# EAGLE design NanoRemote (EAGLE 5.11)
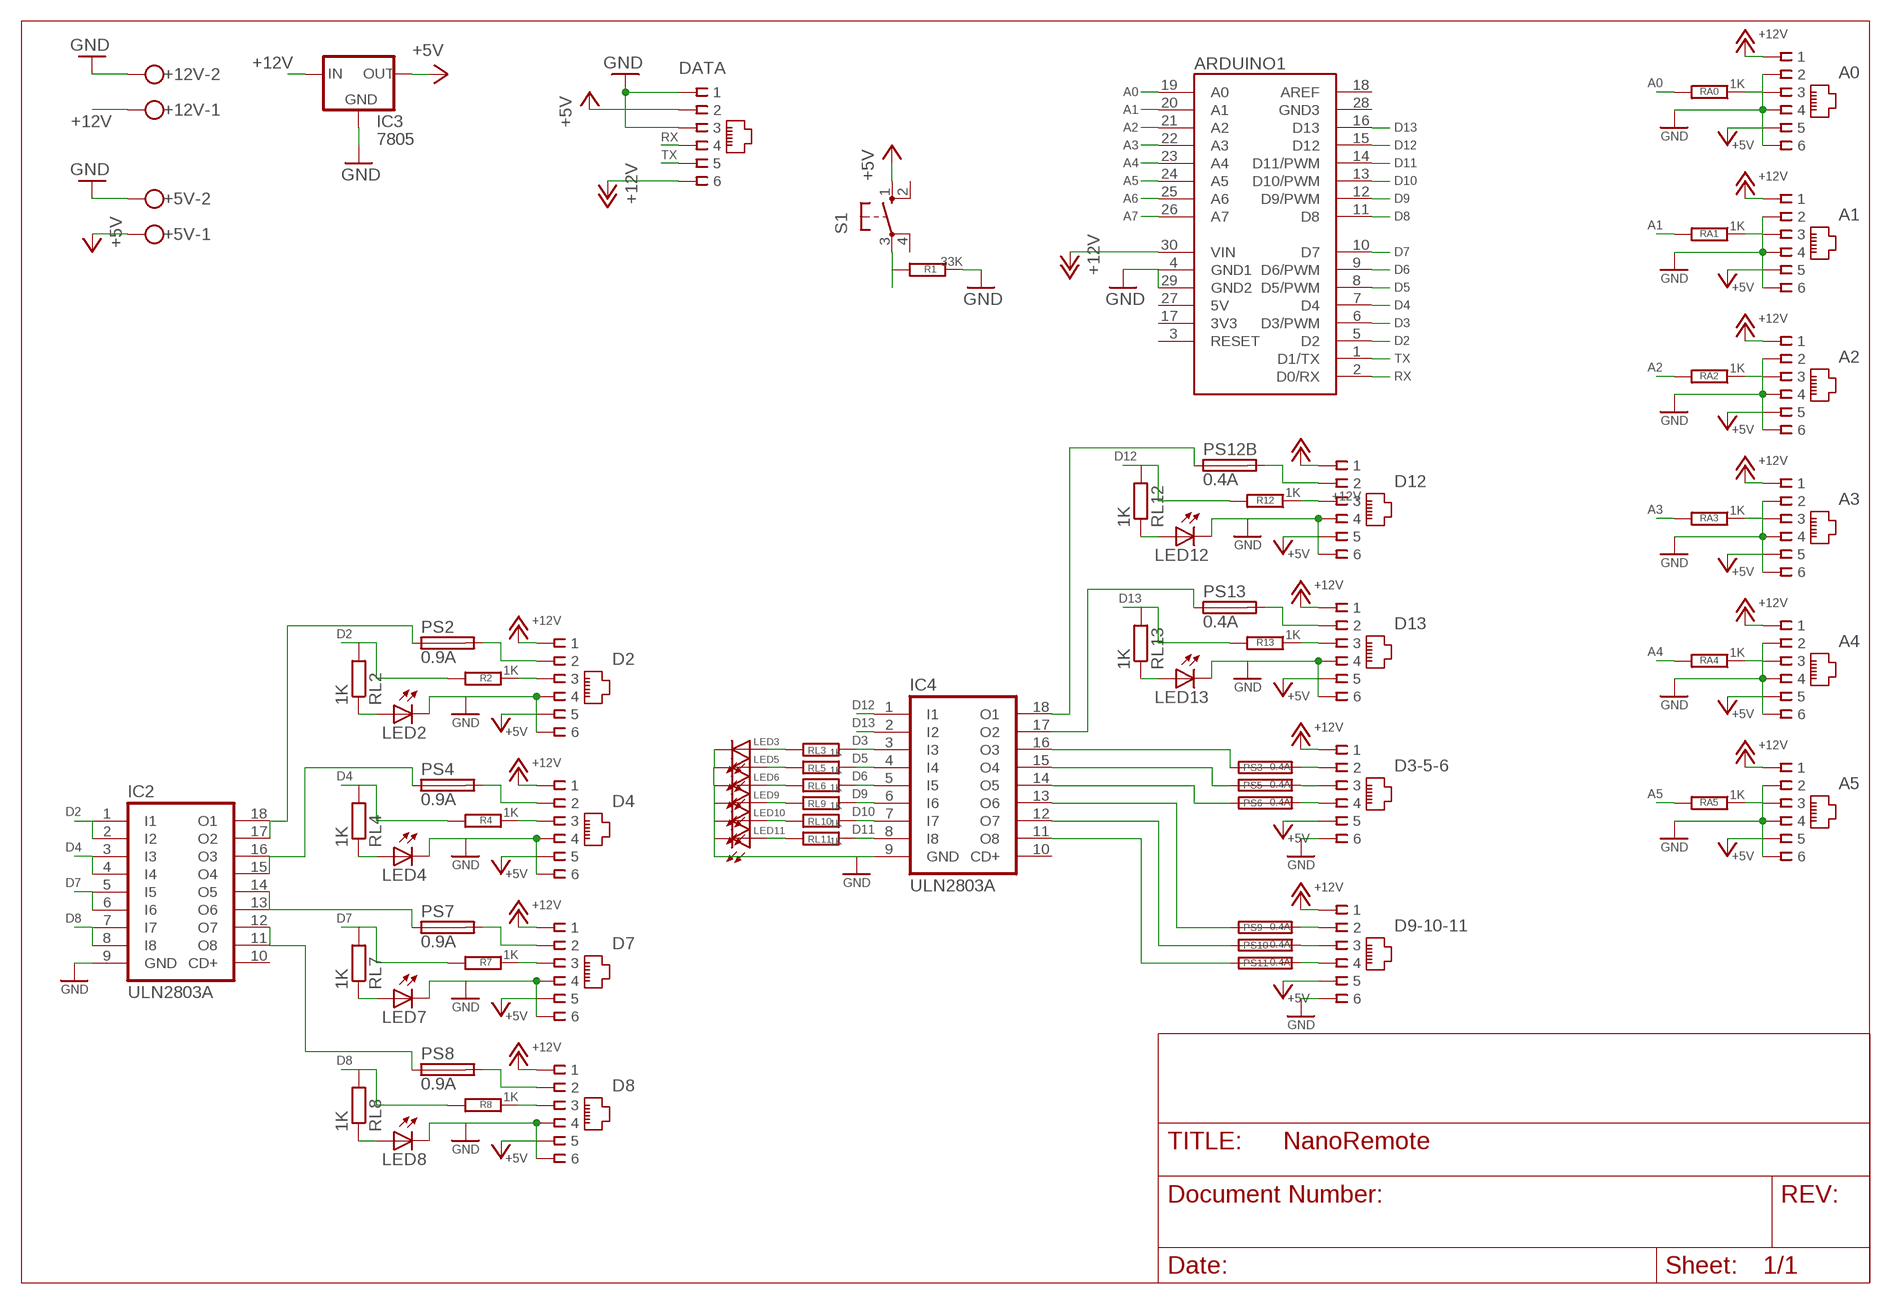
[diagram p0: schematic, sheet 1]

## Parts
+5V  W237-102  [W237-102]
+12V  W237-102  [W237-102]
A0  RJ11-2L-S  [RJ11-NO_SHIELD]
A1  RJ11-2L-S  [RJ11-NO_SHIELD]
A2  RJ11-2L-S  [RJ11-NO_SHIELD]
A3  RJ11-2L-S  [RJ11-NO_SHIELD]
A4  RJ11-2L-S  [RJ11-NO_SHIELD]
A5  RJ11-2L-S  [RJ11-NO_SHIELD]
ARDUINO1  ARDUINO_NANO  [ARDUINO_NANO]
D2  RJ11-2L-S  [RJ11-NO_SHIELD]
D3-5-6  RJ11-2L-S  [RJ11-NO_SHIELD]
D4  RJ11-2L-S  [RJ11-NO_SHIELD]
D7  RJ11-2L-S  [RJ11-NO_SHIELD]
D8  RJ11-2L-S  [RJ11-NO_SHIELD]
D9-10-11  RJ11-2L-S  [RJ11-NO_SHIELD]
D12  RJ11-2L-S  [RJ11-NO_SHIELD]
D13  RJ11-2L-S  [RJ11-NO_SHIELD]
DATA  RJ11-2L-S  [RJ11-NO_SHIELD]
IC2  ULN2803A  [DIL18]
IC3  7805  78XXL  [78XXL]
IC4  ULN2803A  [DIL18]
LED2  LED3MM  [LED3MM]
LED3  LED3MM  [LED3MM]
LED4  LED3MM  [LED3MM]
LED5  LED3MM  [LED3MM]
LED6  LED3MM  [LED3MM]
LED7  LED3MM  [LED3MM]
LED8  LED3MM  [LED3MM]
LED9  LED3MM  [LED3MM]
LED10  LED3MM  [LED3MM]
LED11  LED3MM  [LED3MM]
LED12  LED3MM  [LED3MM]
LED13  LED3MM  [LED3MM]
PS2  0.9A  TE5  [TE5]
PS3  0.4A  TE5  [TE5]
PS4  0.9A  TE5  [TE5]
PS5  0.4A  TE5  [TE5]
PS6  0.4A  TE5  [TE5]
PS7  0.9A  TE5  [TE5]
PS8  0.9A  TE5  [TE5]
PS9  0.4A  TE5  [TE5]
PS10  0.4A  TE5  [TE5]
PS11  0.4A  TE5  [TE5]
PS12B  0.4A  TE5  [TE5]
PS13  0.4A  TE5  [TE5]
R1  33K  R-EU_0207/7  [0207/7]
R2  1K  R-EU_0207/7  [0207/7]
R4  1K  R-EU_0207/7  [0207/7]
R7  1K  R-EU_0207/7  [0207/7]
R8  1K  R-EU_0207/7  [0207/7]
R12  1K  R-EU_0207/7  [0207/7]
R13  1K  R-EU_0207/7  [0207/7]
RA0  1K  R-EU_0207/7  [0207/7]
RA1  1K  R-EU_0207/7  [0207/7]
RA2  1K  R-EU_0207/7  [0207/7]
RA3  1K  R-EU_0207/7  [0207/7]
RA4  1K  R-EU_0207/7  [0207/7]
RA5  1K  R-EU_0207/7  [0207/7]
RL2  1K  R-EU_0207/7  [0207/7]
RL3  1K  R-EU_0207/7  [0207/7]
RL4  1K  R-EU_0207/7  [0207/7]
RL5  1K  R-EU_0207/7  [0207/7]
RL6  1K  R-EU_0207/7  [0207/7]
RL7  1K  R-EU_0207/7  [0207/7]
RL8  1K  R-EU_0207/7  [0207/7]
RL9  1K  R-EU_0207/7  [0207/7]
RL10  1K  R-EU_0207/7  [0207/7]
RL11  1K  R-EU_0207/7  [0207/7]
RL12  1K  R-EU_0207/7  [0207/7]
RL13  1K  R-EU_0207/7  [0207/7]
S1  40-XX  [B3F-40XX]

## Nets
+5V [power]: +5V.1 A0.5 A1.5 A2.5 A3.5 A4.5 A5.5 D2.5 D3-5-6.5 D4.5 D7.5 D8.5 D9-10-11.5 D12.5 D13.5 DATA.2 IC3.OUT S1.1(S)
+12V [highpower]: +12V.1 A0.1 A1.1 A2.1 A3.1 A4.1 A5.1 ARDUINO1.30(VIN) D2.1 D3-5-6.1 D4.1 D7.1 D8.1 D9-10-11.1 D12.1 D13.1 DATA.6 IC3.IN
A0: ARDUINO1.19(A0) RA0.2
A1: ARDUINO1.20(A1) RA1.2
A2: ARDUINO1.21(A2) RA2.2
A3: ARDUINO1.22(A3) RA3.2
A4: ARDUINO1.23(A4) RA4.2
A5: ARDUINO1.24(A5) R1.2 RA5.2 S1.3(P)
A6: ARDUINO1.25(A6)
A7: ARDUINO1.26(A7)
AN0B: A0.3 RA0.1
AN1B: A1.3 RA1.1
AN2B: A2.3 RA2.1
AN3B: A3.3 RA3.1
AN4B: A4.3 RA4.1
AN5B: A5.3 RA5.1
D2: ARDUINO1.5(D2) IC2.1(I1) IC2.2(I2) R2.2 RL2.2
D2B: D2.3 R2.1
D3: ARDUINO1.6(D3/PWM) IC4.3(I3) RL3.2
D4: ARDUINO1.7(D4) IC2.3(I3) IC2.4(I4) R4.2 RL4.2
D4B: D4.3 R4.1
D5: ARDUINO1.8(D5/PWM) IC4.4(I4) RL5.2
D6: ARDUINO1.9(D6/PWM) IC4.5(I5) RL6.2
D7: ARDUINO1.10(D7) IC2.5(I5) IC2.6(I6) R7.2 RL7.2
D7B: D7.3 R7.1
D8: ARDUINO1.11(D8) IC2.7(I7) IC2.8(I8) R8.2 RL8.2
D8B: D8.3 R8.1
D9: ARDUINO1.12(D9/PWM) IC4.6(I6) RL9.2
D10: ARDUINO1.13(D10/PWM) IC4.7(I7) RL10.2
D11: ARDUINO1.14(D11/PWM) IC4.8(I8) RL11.2
D12: ARDUINO1.15(D12) IC4.1(I1) R12.2 RL12.2
D12B: D12.3 R12.1
D13: ARDUINO1.16(D13) IC4.2(I2) R13.2 RL13.2
D13B: D13.3 R13.1
GND [highpower]: +5V.2 +12V.2 A0.2 A0.4 A0.6 A1.2 A1.4 A1.6 A2.2 A2.4 A2.6 A3.2 A3.4 A3.6 A4.2 A4.4 A4.6 A5.2 A5.4 A5.6 ARDUINO1.4(GND1) ARDUINO1.29(GND2) D2.4 D2.6 D3-5-6.6 D4.4 D4.6 D7.4 D7.6 D8.4 D8.6 D9-10-11.6 D12.4 D12.6 D13.4 D13.6 DATA.1 DATA.3 IC2.9(GND) IC3.GND IC4.9(GND) LED2.K(C) LED3.K(C) LED4.K(C) LED5.K(C) LED6.K(C) LED7.K(C) LED8.K(C) LED9.K(C) LED10.K(C) LED11.K(C) LED12.K(C) LED13.K(C) R1.1
N$1 [power]: IC4.17(O2) PS13.1
N$2 [power]: D9-10-11.2 PS9.2
N$3 [power]: D9-10-11.3 PS10.2
N$4 [power]: D9-10-11.4 PS11.2
N$5 [power]: IC4.16(O3) PS3.1
N$6 [power]: IC4.15(O4) PS5.1
N$7 [power]: IC4.14(O5) PS6.1
N$8 [power]: IC4.13(O6) PS9.1
N$9 [power]: IC4.12(O7) PS10.1
N$10 [power]: IC4.11(O8) PS11.1
N$11: LED5.A RL5.1
N$12 [power]: IC2.17(O2) IC2.18(O1) PS2.1
N$13: LED12.A RL12.1
N$14: LED6.A RL6.1
N$15: LED2.A RL2.1
N$16: LED9.A RL9.1
N$17 [power]: D12.2 PS12B.2
N$18 [power]: D2.2 PS2.2
N$19: LED10.A RL10.1
N$20: LED4.A RL4.1
N$21 [power]: D4.2 PS4.2
N$22 [power]: IC4.18(O1) PS12B.1
N$23: LED11.A RL11.1
N$24: LED7.A RL7.1
N$25 [power]: D7.2 PS7.2
N$26: LED13.A RL13.1
N$27 [power]: D13.2 PS13.2
N$28: LED8.A RL8.1
N$29 [power]: D8.2 PS8.2
N$31: LED3.A RL3.1
N$32 [power]: D3-5-6.2 PS3.2
N$34 [power]: IC2.11(O8) IC2.12(O7) PS8.1
N$37 [power]: D3-5-6.3 PS5.2
N$39 [power]: D3-5-6.4 PS6.2
N$40 [power]: IC2.15(O4) IC2.16(O3) PS4.1
N$41 [power]: IC2.13(O6) IC2.14(O5) PS7.1
RX: ARDUINO1.2(D0/RX) DATA.4
TX: ARDUINO1.1(D1/TX) DATA.5
Unconnected: ARDUINO1.3(RESET) ARDUINO1.18(AREF) ARDUINO1.28(GND3) IC2.10(CD+) IC4.10(CD+) S1.2(S1) S1.4(P1)

## Power pins joined to a net without a drawn wire
3V3: ARDUINO1.17(3V3)
5V: ARDUINO1.27(5V)

## Library data of the parts
+5V +12V = con-wago-500:W237-102: WAGO SCREW CLAMP; MPN: 237-102; OC_FARNELL: unknown; OC_NEWARK: 70K9898
A0 A1-A5 D2 D3-5-6 D4 D7 D8 D9-10-11 D12 D13 DATA = con-tycoelectronics:RJ11: CORCOM Modular RJ Jacks No Shield Source: www.tycoelectronics.com .. ENG_DS_1654001_1099_RJ_L_0507.pdf; MPN: RJ11-2L-S; OC_FARNELL: unknown; OC_NEWARK: 73K3294
ARDUINO1 = arduino:ARDUINO_NANO: Arduino Nano I/O pin arrangement
IC2 IC4 = uln-udn:ULN2803A: DRIVER ARRAY
IC3 = v-reg:78XXL: VOLTAGE REGULATOR
LED2-LED13 = led:LED: LED OSRAM: - CHIPLED LG R971, LG N971, LY N971, LG Q971, LY Q971, LO R971, LY R971 LH N974, LH R974 LS Q976, LO Q976, LY Q976 LO Q996 - Hyper CHIPLED LW Q18S LB Q993, LB Q99A, LB R99A - SideLED LS A670, LO A670, LY A670, LG A670, LP A670 LB A673, LV A673, LT A673, LW A673 LH A674 LY A675 LS A676, LA A676, LO A676, LY A676, LW A676 LS A679, LY A679, LG A679 - Hyper Micro SIDELED® LS Y876, LA Y876, LO Y876, LY Y876 LT Y87S - SmartLED LW L88C, LW L88S LB L89C, LB L89S, LG L890 LS L89K, LO L89K, LY L89K LS L896, LA L896, LO L896, LY L896 - TOPLED LS T670, LO T670, LY T670, LG T670, LP T670 LSG T670, LSP T670, LSY T670, LOP T670, LYG T670 LG T671, LOG T671, LSG T671 LB T673, LV T673, LT T673, LW T673 LH T674 LS T676, LA T676, LO T676, LY T676, LB T676, LH T676, LSB T676, LW T676 LB T67C, LV T67C, LT T67C, LS T67K, LO T67K, LY T67K, LW E67C LS E67B, LA E67B, LO E67B, LY E67B, LB E67C, LV E67C, LT E67C LW T67C LS T679, LY T679, LG T679 LS T770, LO T770, LY T770, LG T770, LP T770 LB T773, LV T773, LT T773, LW T773 LH T774 LS E675, LA E675, LY E675, LS T675 LS T776, LA T776, LO T776, LY T776, LB T776 LHGB T686 LT T68C, LB T68C - Hyper Mini TOPLED® LB M676 - Mini TOPLED Santana® LG M470 LS M47K, LO M47K, LY M47K Source: http://www.osram.convergy.de LUXEON: - LUMILED® LXK2-PW12-R00, LXK2-PW12-S00, LXK2-PW14-U00, LXK2-PW14-V00 LXK2-PM12-R00, LXK2-PM12-S00, LXK2-PM14-U00 LXK2-PE12-Q00, LXK2-PE12-R00, LXK2-PE12-S00, LXK2-PE14-T00, LXK2-PE14-U00 LXK2-PB12-K00, LXK2-PB12-L00, LXK2-PB12-M00, LXK2-PB14-N00, LXK2-PB14-P00, LXK2-PB14-Q00 LXK2-PR12-L00, LXK2-PR12-M00, LXK2-PR14-Q00, LXK2-PR14-R00 LXK2-PD12-Q00, LXK2-PD12-R00, LXK2-PD12-S00 LXK2-PH12-R00, LXK2-PH12-S00 LXK2-PL12-P00, LXK2-PL12-Q00, LXK2-PL12-R00 Source: www.luxeon.com KINGBRIGHT: KA-3528ASYC Source: www.kingbright.com
PS2-PS11 PS12B PS13 = fuse:TE5: FUSE Wickmann; OC_FARNELL: unknown; OC_NEWARK: unknown
R1 R2 R4 R7 R8 R12 R13 RA0 RA1-RA5 RL2-RL13 = rcl:R-EU_: RESISTOR, European symbol
S1 = switch-omron:40-XX: OMRON SWITCH; MF: OMRON COMPONENTS USA; MPN: B3F-4000; OC_FARNELL: 176434; OC_NEWARK: 36K3105

## Net classes
0 default: width 0.457 mm
1 power: width 0.914 mm
2 highpower: width 1.372 mm

## Board
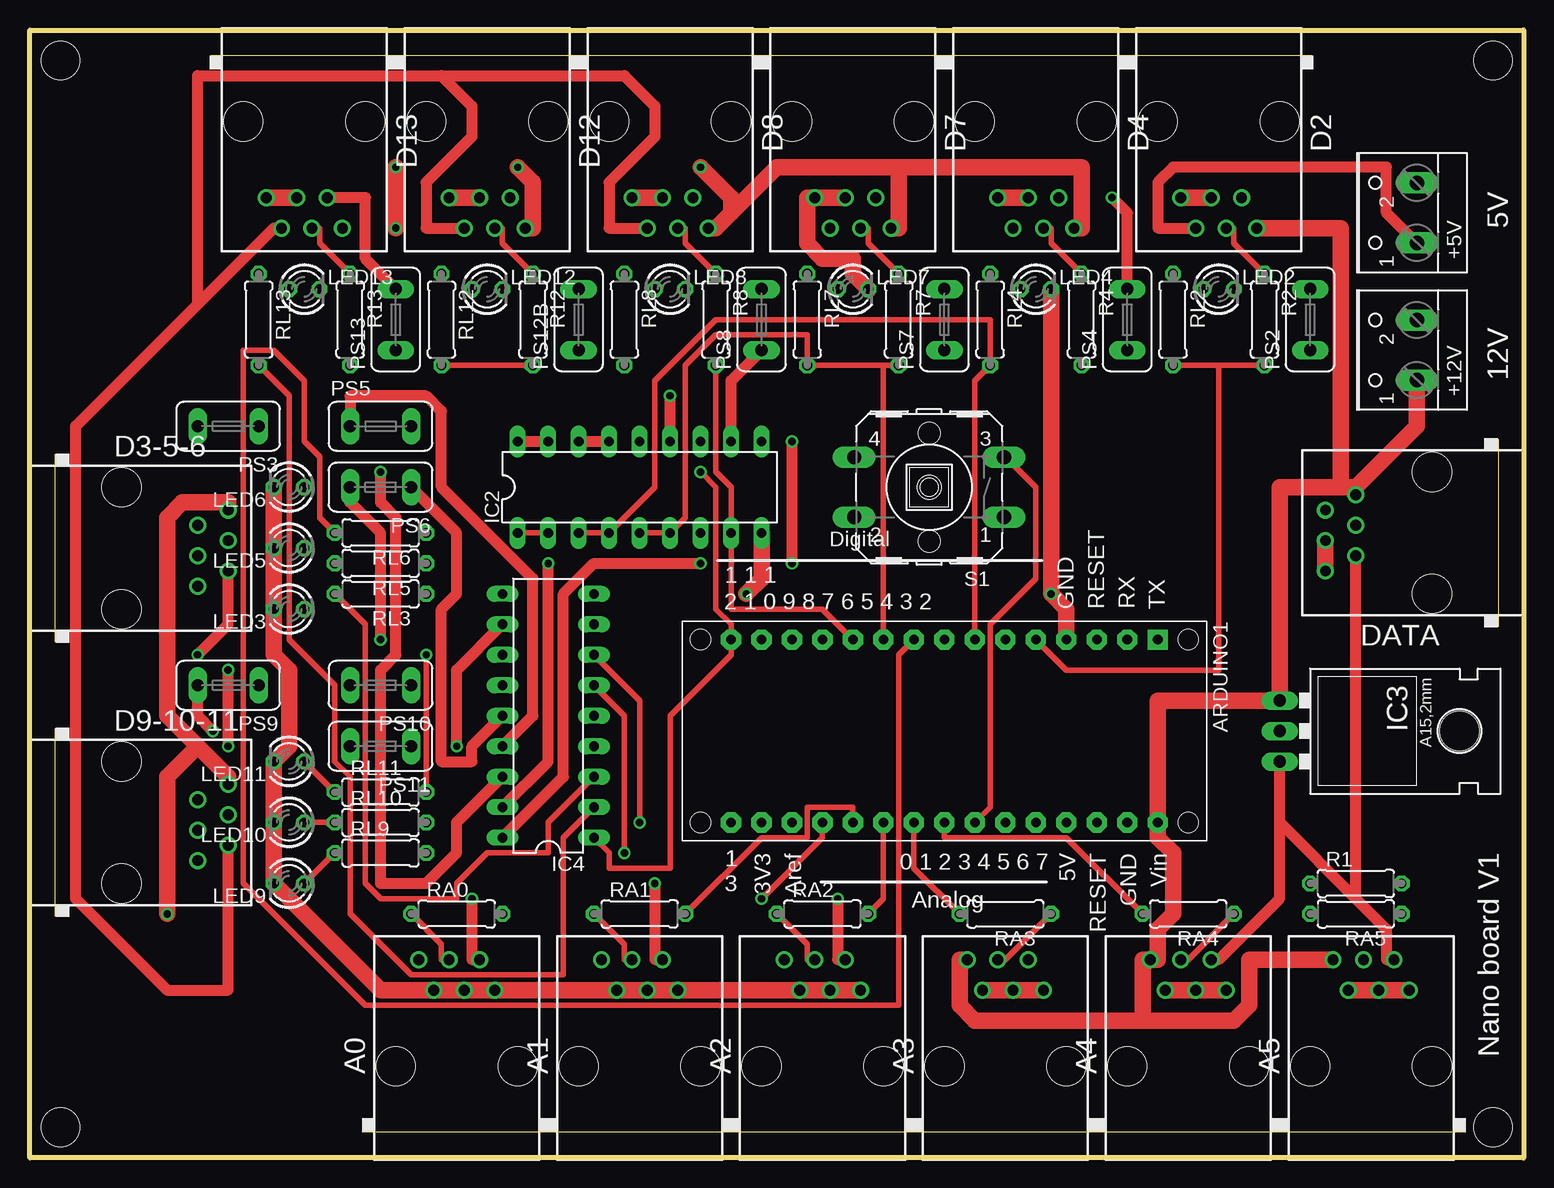
[diagram p1: board, top side]
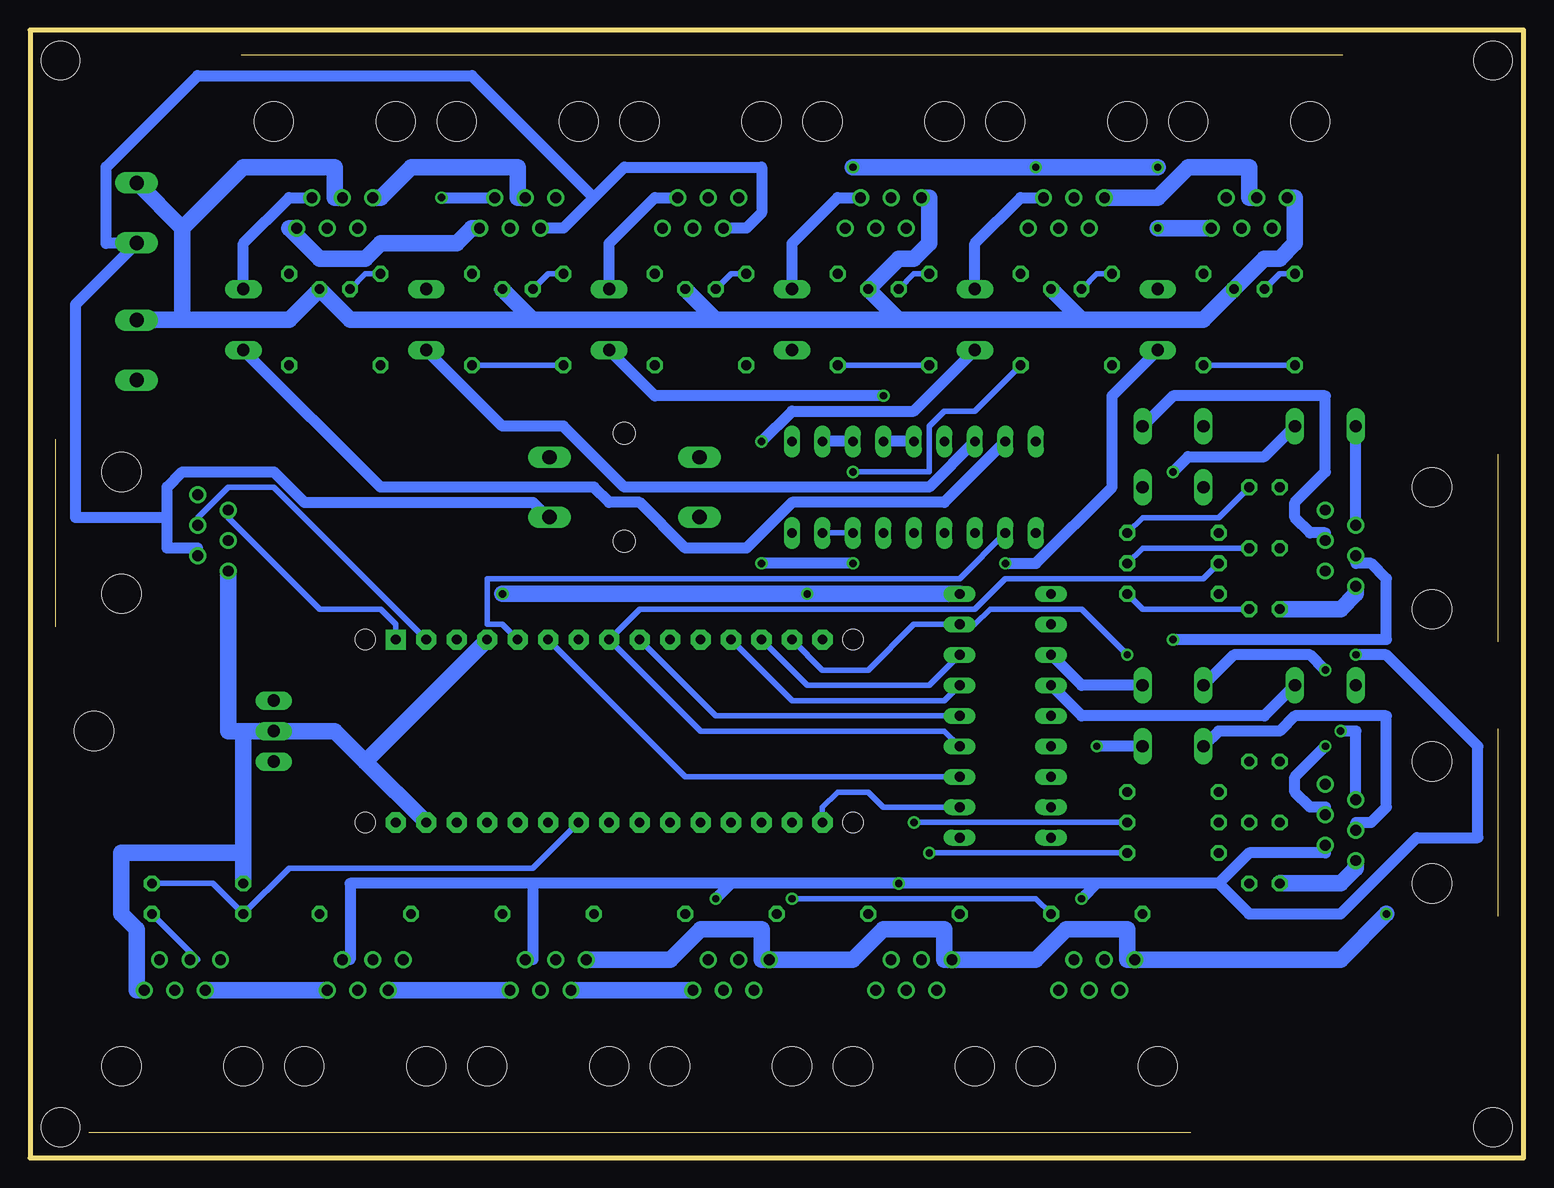
[diagram p2: board, bottom side, seen from below]

Size 124.46 x 93.98 mm. Coordinates in mm from the lower left corner, seen from the top.
Outline: 0,93.98 124.46,93.98 124.46,0 0,0 0,93.98
Copper layers (1*16): Top 0.035mm / dielectric 1.5mm / Bottom 0.035mm
Design rules "default": minimum track width 10mil, minimum drill 24mil, track to track 8mil, track to pad 8mil, pad to pad 8mil, via to via 8mil, smd to smd 8mil, copper to edge 40mil, drill to drill 8mil, minimum pad ring 10mil, minimum via ring 8mil, stop-mask expansion 4mil, vias tented up to drill 0mil, thermal gap 10mil
Holes 3.2 mm at 2.54,91.44 2.54,2.54 121.92,2.54 121.92,91.44

### Footprints (pad centres in the part's own frame; a part is rotated, then mirrored left to right if it is on the bottom)
W237-102 = drill 1.194 long: 1 -2.5,-1.27; 2 2.5,-1.27
RJ11-NO_SHIELD = drill 0.9 pad 1.4 round: 1 -3.175,8.89; 2 -1.905,6.35; 3 -0.635,8.89; 4 0.635,6.35; 5 1.905,8.89; 6 3.175,6.35 | hole 3.251: -5.08,0; 5.08,0
ARDUINO_NANO = drill 0.8 pad 1.676 square: 1 0,-2.54 | drill 0.8 pad 1.676 octagon: 2 0,-5.08; 3 0,-7.62; 4 0,-10.16; 5 0,-12.7; 6 0,-15.24; 7 0,-17.78; 8 0,-20.32; 9 0,-22.86; 10 0,-25.4; 11 0,-27.94; 12 0,-30.48; 13 0,-33.02; 14 0,-35.56; 15 0,-38.1; 16 15.24,-38.1; 17 15.24,-35.56; 18 15.24,-33.02; 19 15.24,-30.48; 20 15.24,-27.94; 21 15.24,-25.4; 22 15.24,-22.86; 23 15.24,-20.32; 24 15.24,-17.78; 25 15.24,-15.24; 26 15.24,-12.7; 27 15.24,-10.16; 28 15.24,-7.62; 29 15.24,-5.08; 30 15.24,-2.54 | hole 1.676: 0,0; 0,-40.64; 15.24,-40.64; 15.24,0
DIL18 = drill 0.813 long: 1 -10.16,-3.81; 2 -7.62,-3.81; 3 -5.08,-3.81; 4 -2.54,-3.81; 5 0,-3.81; 6 2.54,-3.81; 7 5.08,-3.81; 8 7.62,-3.81; 9 10.16,-3.81; 10 10.16,3.81; 11 7.62,3.81; 12 5.08,3.81; 13 2.54,3.81; 14 0,3.81; 15 -2.54,3.81; 16 -5.08,3.81; 17 -7.62,3.81; 18 -10.16,3.81
78XXL = drill 1.016 long: GND 0,-3.81; IN -2.54,-3.81; OUT 2.54,-3.81 | hole 3.302: 0,11.176
LED3MM = drill 0.813 octagon: A -1.27,0; K 1.27,0
TE5 = drill 1.016 long: 1 -2.54,0; 2 2.54,0
0207/7 = drill 0.813 octagon: 1 -3.81,0; 2 3.81,0
B3F-40XX = drill 1.194 long: 1 -6.248,2.489; 2 6.248,2.489; 3 -6.248,-2.489; 4 6.248,-2.489 | hole 1.803: 0,-4.496; 0,4.496

### Placement (x,y rotation side)
+5V  114.3,78.74 90 top
+12V  114.3,67.31 90 top
A0  35.56,7.62 0 top
A1  50.8,7.62 0 top
A2  66.04,7.62 0 top
A3  81.28,7.62 0 top
A4  96.52,7.62 0 top
A5  111.76,7.62 0 top
ARDUINO1  96.52,43.18 270 top
D2  99.06,86.36 180 top
D3-5-6  7.62,50.8 270 top
D4  83.82,86.36 180 top
D7  68.58,86.36 180 top
D8  53.34,86.36 180 top
D9-10-11  7.62,27.94 270 top
D12  38.1,86.36 180 top
D13  22.86,86.36 180 top
DATA  116.84,52.07 90 top
IC2  50.8,55.88 0 top
IC3  107.95,35.56 270 top
IC4  43.18,36.83 90 top
LED2  99.06,72.39 0 top
LED3  21.59,45.72 180 top
LED4  83.82,72.39 0 top
LED5  21.59,50.8 180 top
LED6  21.59,55.88 180 top
LED7  68.58,72.39 0 top
LED8  53.34,72.39 0 top
LED9  21.59,22.86 180 top
LED10  21.59,27.94 180 top
LED11  21.59,33.02 180 top
LED12  38.1,72.39 0 top
LED13  22.86,72.39 0 top
PS2  106.68,69.85 90 top
PS3  16.51,60.96 180 top
PS4  91.44,69.85 90 top
PS5  29.21,60.96 0 top
PS6  29.21,55.88 180 top
PS7  76.2,69.85 90 top
PS8  60.96,69.85 90 top
PS9  16.51,39.37 180 top
PS10  29.21,39.37 180 top
PS11  29.21,34.29 180 top
PS12B  45.72,69.85 90 top
PS13  30.48,69.85 90 top
R1  110.49,22.86 0 top
R2  102.87,69.85 270 top
R4  87.63,69.85 270 top
R7  72.39,69.85 270 top
R8  57.15,69.85 270 top
R12  41.91,69.85 270 top
R13  26.67,69.85 270 top
RA0  35.56,20.32 0 top
RA1  50.8,20.32 0 top
RA2  66.04,20.32 0 top
RA3  81.28,20.32 180 top
RA4  96.52,20.32 180 top
RA5  110.49,20.32 180 top
RL2  95.25,69.85 270 top
RL3  29.21,46.99 180 top
RL4  80.01,69.85 270 top
RL5  29.21,49.53 180 top
RL6  29.21,52.07 180 top
RL7  64.77,69.85 270 top
RL8  49.53,69.85 270 top
RL9  29.21,25.4 0 top
RL10  29.21,27.94 0 top
RL11  29.21,30.48 0 top
RL12  34.29,69.85 270 top
RL13  19.05,69.85 270 top
S1  74.93,55.88 180 top

### Tracks (layer width: path | path; a pad name or v marks a point on that pad's centre or on a via)
+5V  (via drill 0.61)
  Top 0.914: D2.5 93.98,77.47 93.98,81.28 95.25,82.55 113.03,82.55 113.03,78.74 115.57,76.2 +5V.1 | 104.14,27.94 IC3.OUT | 104.14,27.94 104.14,21.59 99.06,16.51 A4.5 | 104.14,27.94 110.49,21.59 | 110.49,21.59 113.03,19.05 113.03,16.51 A5.5 | 110.49,21.59 DATA.2 | v36.83,21.59 36.83,16.51 A0.5 | v52.07,22.86 52.07,16.51 A1.5 | v67.31,21.59 67.31,16.51 A2.5 | v13.97,41.91 16.51,44.45 D3-5-6.5 | 13.97,71.12 3.81,60.96 3.81,21.59 11.43,13.97 16.51,13.97 D9-10-11.5 | 13.97,71.12 20.32,77.47 D13.5 | 34.29,90.17 36.83,87.63 36.83,85.09 33.02,81.28 33.02,77.47 D12.5 | 34.29,90.17 13.97,90.17 13.97,71.12 | 34.29,90.17 49.53,90.17 52.07,87.63 52.07,85.09 48.26,81.28 48.26,77.47 D8.5
  Bottom 0.914: 77.47,80.01 80.01,77.47 D4.5 | 77.47,80.01 74.93,82.55 63.5,82.55 63.5,78.74 64.77,77.47 D7.5 | 77.47,80.01 87.63,90.17 110.49,90.17 118.11,82.55 118.11,76.2 115.57,76.2 | 113.03,53.34 113.03,50.8 110.49,50.8 DATA.2 | 113.03,53.34 113.03,55.88 111.76,57.15 104.14,57.15 101.6,54.61 82.55,54.61 81.28,53.34 S1.1 | 115.57,76.2 120.65,71.12 120.65,53.34 113.03,53.34 | 115.57,76.2 +5V.1 | 35.56,22.86 v36.83,21.59 | 25.4,22.86 35.56,22.86 | 25.4,22.86 22.86,25.4 16.51,25.4 D9-10-11.5 | 35.56,22.86 v52.07,22.86 66.04,22.86 | 66.04,22.86 v67.31,21.59 | 82.55,22.86 82.55,16.51 A3.5 | 66.04,22.86 82.55,22.86 | v13.97,41.91 11.43,41.91 3.81,34.29 3.81,26.67 8.89,26.67 15.24,20.32 22.86,20.32 25.4,22.86 | 82.55,22.86 97.79,22.86 97.79,16.51 A4.5
+12V  (via drill 0.61)
  Top 1.372: 13.97,34.29 11.43,36.83 11.43,53.34 12.7,54.61 16.51,54.61 D3-5-6.1 | 13.97,34.29 16.51,31.75 D9-10-11.1 | 13.97,34.29 11.43,31.75 v11.43,20.32 | v30.48,82.55 v30.48,77.47 | v40.64,82.55 41.91,81.28 41.91,77.47 D12.1 | 58.42,78.74 62.23,82.55 72.39,82.55 | 58.42,78.74 57.15,77.47 D8.1 | 72.39,82.55 72.39,77.47 D7.1 | v55.88,82.55 58.42,80.01 58.42,78.74 | 110.49,55.88 115.57,60.96 +12V.1 | 92.71,11.43 100.33,11.43 101.6,12.7 101.6,16.51 A5.1 | 92.71,11.43 92.71,16.51 A4.1 93.98,16.51 93.98,19.05 95.25,20.32 95.25,25.4 93.98,26.67 ARDUINO1.30 93.98,38.1 IC3.IN 104.14,55.88 109.22,55.88 | 109.22,55.88 110.49,55.88 | 110.49,55.88 DATA.6 | 109.22,55.88 109.22,77.47 D2.1 | 72.39,82.55 87.63,82.55 87.63,77.47 D4.1 | 92.71,11.43 78.74,11.43 77.47,12.7 77.47,16.51 A3.1
  Bottom 1.372: A3.1 71.12,16.51 68.58,19.05 63.5,19.05 63.5,16.51 A2.1 55.88,16.51 53.34,19.05 48.26,19.05 48.26,16.51 A1.1 40.64,16.51 38.1,19.05 33.02,19.05 33.02,16.51 A0.1 15.24,16.51 v11.43,20.32 | v30.48,82.55 v40.64,82.55 v55.88,82.55 | v30.48,77.47 D13.1 | D4.1 87.63,77.47 88.9,76.2 95.25,76.2 96.52,74.93 100.33,74.93 102.87,77.47 D2.1
A0  (via drill 0.61)
  Top 0.457: v60.96,21.59 66.04,26.67 ARDUINO1.19
  Bottom 0.457: RA0.2 40.64,21.59 v60.96,21.59
A1
  Top 0.457: RA1.2 60.96,26.67 64.77,26.67 64.77,29.21 68.58,29.21 ARDUINO1.20
A2
  Top 0.457: RA2.2 71.12,21.59 ARDUINO1.21
A3
  Top 0.457: RA3.2 73.66,24.13 ARDUINO1.22
A4
  Top 0.457: RA4.2 86.36,26.67 76.2,26.67 ARDUINO1.23
A5
  Top 0.457: ARDUINO1.24 80.01,29.21 80.01,44.45 83.82,48.26 83.82,55.88 81.28,58.42 S1.3
  Bottom 0.457: R1.2 109.22,22.86 RA5.2 102.87,24.13 82.55,24.13 ARDUINO1.24
AN0B
  Top 0.457: RA0.1 34.29,17.78 34.29,16.51 A0.3
AN1B
  Top 0.457: RA1.1 49.53,17.78 49.53,16.51 A1.3
AN2B
  Top 0.457: RA2.1 64.77,17.78 64.77,16.51 A2.3
AN3B
  Top 0.457: RA3.1 81.28,16.51 A3.3
AN4B
  Top 0.457: RA4.1 96.52,16.51 A4.3
AN5B
  Bottom 0.457: RA5.1 110.49,16.51 A5.3
D2
  Top 0.457: IC2.1 IC2.2 | 99.06,66.04 R2.2 | 99.06,66.04 RL2.2 | ARDUINO1.5 86.36,40.64 99.06,40.64 99.06,66.04
  Bottom 0.457: IC2.2 46.99,48.26 86.36,48.26 86.36,44.45 85.09,44.45 ARDUINO1.5
D2B
  Top 0.457: R2.1 100.33,76.2 100.33,77.47 D2.3
D3
  Top 0.457: RL3.2 27.94,44.45 27.94,22.86 29.21,21.59 35.56,21.59 35.56,22.86 38.1,25.4 43.18,25.4 43.18,27.94 IC4.3
  Bottom 0.457: ARDUINO1.6 69.85,31.75 IC4.3
D4
  Top 0.457: IC2.3 IC2.4 52.07,55.88 52.07,64.77 57.15,69.85 80.01,69.85 RL4.2 78.74,64.77 ARDUINO1.7
  Bottom 0.457: RL4.2 R4.2
D4B
  Top 0.457: R4.1 85.09,76.2 85.09,77.47 D4.3
D5
  Bottom 0.457: RL5.2 26.67,48.26 43.18,48.26 45.72,45.72 73.66,45.72 ARDUINO1.8 68.58,35.56 48.26,35.56 IC4.4
D6
  Top 0.457: RL6.2 24.13,53.34 24.13,58.42 22.86,59.69 22.86,64.77 20.32,67.31 17.78,67.31 17.78,22.86 27.94,12.7 72.39,12.7 72.39,41.91 ARDUINO1.9
  Bottom 0.457: IC4.5 67.31,36.83 ARDUINO1.9
D7
  Top 0.457: IC2.5 IC2.6 54.61,53.34 54.61,66.04 57.15,68.58 64.77,68.58 RL7.2 71.12,66.04 | 71.12,66.04 R7.2 | 71.12,66.04 ARDUINO1.10
D7B
  Top 0.457: R7.1 69.85,76.2 69.85,77.47 D7.3
D8
  Top 0.457: ARDUINO1.11 66.04,45.72 58.42,45.72 IC2.8 58.42,55.88 57.15,57.15 R8.2
  Bottom 0.457: R8.2 RL8.2 | IC2.8 IC2.7
D8B
  Top 0.457: R8.1 54.61,76.2 54.61,77.47 D8.3
D9  (via drill 0.61)
  Top 0.457: v49.53,25.4 49.53,36.83 IC4.6
  Bottom 0.457: RL9.2 v49.53,25.4 | ARDUINO1.12 60.96,38.1 48.26,38.1 IC4.6
D10  (via drill 0.61)
  Top 0.457: v50.8,27.94 50.8,38.1 IC4.7
  Bottom 0.457: RL10.2 v50.8,27.94 | ARDUINO1.13 59.69,39.37 49.53,39.37 IC4.7
D11  (via drill 0.61)
  Top 0.457: RL11.2 v33.02,41.91
  Bottom 0.457: v33.02,41.91 36.83,45.72 44.45,45.72 45.72,44.45 IC4.8 50.8,44.45 54.61,40.64 58.42,40.64 ARDUINO1.14
D12  (via drill 0.61)
  Top 0.457: R12.2 RL12.2 | IC4.1 48.26,25.4 48.26,24.13 53.34,24.13 53.34,36.83 58.42,41.91 ARDUINO1.15 58.42,44.45 57.15,45.72 57.15,55.88 v55.88,57.15
  Bottom 0.457: R12.2 45.72,62.23 48.26,62.23 49.53,60.96 49.53,57.15 v55.88,57.15
D12B
  Top 0.457: R12.1 39.37,76.2 39.37,77.47 D12.3
D13
  Top 0.457: RL13.2 21.59,63.5 21.59,43.18 25.4,39.37 25.4,33.02 26.67,31.75 26.67,20.32 31.75,15.24 44.45,15.24 44.45,26.67 IC4.2
  Bottom 0.457: RL13.2 R13.2 | IC4.2 53.34,29.21 54.61,30.48 57.15,30.48 58.42,29.21 ARDUINO1.16
D13B
  Top 0.457: R13.1 24.13,76.2 24.13,77.47 D13.3
GND  (via drill 0.61)
  Top 1.372: LED6.K LED5.K LED3.K 20.32,41.91 21.59,40.64 21.59,34.29 LED11.K LED10.K LED9.K 29.21,13.97 A0.2 A0.4 A0.6 A1.2 A1.4 A1.6 A2.2 A2.4 A2.6 | A4.2 A4.4 A4.6 | A5.2 A5.4 A5.6 | A3.2 A3.4 A3.6 | v59.69,46.99 60.96,48.26 IC2.9 | DATA.1 DATA.3 | ARDUINO1.4 86.36,45.72 v85.09,46.99 LED4.K | D4.4 D4.6 | D2.4 D2.6 | D13.6 D13.4 | D12.6 D12.4 | D7.4 D7.6 64.77,80.01 64.77,76.2 66.04,74.93 68.58,74.93 68.58,73.66 LED7.K | D8.6 D8.4
  Bottom 1.372: LED9.K 15.24,22.86 13.97,24.13 D9-10-11.6 | LED3.K 15.24,45.72 13.97,46.99 D3-5-6.6 | A4.6 A5.2 | A2.6 A3.2 | A3.6 A4.2 | IC4.9 v59.69,46.99 v85.09,46.99 | 106.68,25.4 106.68,35.56 | 106.68,25.4 R1.1 | 106.68,35.56 IC3.GND 99.06,35.56 96.52,33.02 | 96.52,33.02 ARDUINO1.29 | 96.52,33.02 ARDUINO1.4 | 106.68,35.56 107.95,35.56 DATA.1 | D4.4 83.82,80.01 83.82,82.55 92.71,82.55 95.25,80.01 D2.6 | 111.76,69.85 115.57,69.85 +12V.2 | 111.76,69.85 102.87,69.85 LED2.K 97.79,69.85 82.55,69.85 | 111.76,77.47 115.57,81.28 +5V.2 | 111.76,69.85 111.76,77.47 | 111.76,77.47 106.68,82.55 99.06,82.55 99.06,80.01 D2.4 | D13.4 22.86,80.01 22.86,82.55 27.94,82.55 30.48,80.01 D12.6 | 36.83,69.85 26.67,69.85 LED13.K 21.59,74.93 20.32,74.93 19.05,76.2 19.05,80.01 D13.6 | 36.83,69.85 LED12.K | 52.07,69.85 LED8.K 52.07,74.93 50.8,74.93 49.53,76.2 49.53,80.01 D8.6 | 52.07,69.85 36.83,69.85 | 67.31,69.85 LED7.K | 67.31,69.85 52.07,69.85 | LED4.K 82.55,69.85 | 82.55,69.85 67.31,69.85 | 106.68,25.4 116.84,25.4 116.84,20.32 115.57,19.05 115.57,13.97 A5.6
N$1  (via drill 0.61)
  Top 0.914: IC4.17 43.18,33.02 v43.18,49.53
  Bottom 0.914: v43.18,49.53 40.64,49.53 34.29,55.88 34.29,63.5 PS13.1
N$2  (via drill 0.61)
  Top 0.914: v15.24,35.56 13.97,36.83 PS9.2
  Bottom 0.914: v15.24,35.56 13.97,35.56 D9-10-11.2
N$3  (via drill 0.61)
  Top 0.914: v16.51,34.29 v16.51,40.64
  Bottom 0.914: v16.51,34.29 19.05,31.75 19.05,30.48 17.78,29.21 16.51,29.21 D9-10-11.3 | v16.51,40.64 17.78,41.91 24.13,41.91 PS10.2
N$4
  Bottom 0.914: PS11.2 25.4,35.56 20.32,35.56 19.05,36.83 11.43,36.83 11.43,29.21 12.7,27.94 13.97,27.94 D9-10-11.4
N$5  (via drill 0.61)
  Top 0.914: IC4.16 35.56,27.94 35.56,25.4 33.02,22.86 29.21,22.86 29.21,40.64 30.48,41.91 30.48,53.34 29.21,54.61 v29.21,57.15
  Bottom 0.914: v29.21,57.15 27.94,58.42 21.59,58.42 PS3.1
N$6
  Top 0.914: IC4.15 41.91,36.83 41.91,48.26 34.29,55.88 34.29,62.23 33.02,63.5 26.67,63.5 PS5.1
N$7
  Top 0.914: IC4.14 36.83,34.29 36.83,33.02 34.29,33.02 34.29,45.72 35.56,46.99 35.56,52.07 PS6.1
N$8
  Bottom 0.914: IC4.13 36.83,36.83 21.59,36.83 PS9.1
N$9
  Bottom 0.914: IC4.12 36.83,39.37 PS10.1
N$10  (via drill 0.61)
  Top 0.914: IC4.11 35.56,40.64 v35.56,34.29
  Bottom 0.914: PS11.1 v35.56,34.29
N$11
  Bottom 0.457: LED5.A 31.75,50.8 RL5.1
N$12
  Top 0.914: IC2.18 IC2.17
  Bottom 0.914: PS2.1 95.25,55.88 77.47,55.88 76.2,54.61 73.66,54.61 69.85,50.8 64.77,50.8 60.96,54.61 48.26,54.61 IC2.17
N$13
  Bottom 0.457: LED12.A 35.56,73.66 RL12.1
N$14
  Bottom 0.457: LED6.A 25.4,53.34 31.75,53.34 RL6.1
N$15
  Bottom 0.457: LED2.A 96.52,73.66 RL2.1
N$16
  Top 0.457: LED9.A RL9.1
N$17
  Bottom 0.914: PS12B.2 45.72,76.2 41.91,80.01 D12.2
N$18
  Bottom 0.914: PS2.2 106.68,76.2 102.87,80.01 D2.2
N$19
  Top 0.457: LED10.A RL10.1
N$20
  Bottom 0.457: LED4.A 81.28,73.66 RL4.1
N$21  (via drill 0.61)
  Top 0.914: v90.17,80.01 91.44,78.74 PS4.2
  Bottom 0.914: v90.17,80.01 D4.2
N$22  (via drill 0.61)
  Top 0.914: IC4.18 44.45,31.75 44.45,46.99 46.99,49.53 v55.88,49.53 | v63.5,49.53 v63.5,59.69
  Bottom 0.914: v55.88,49.53 v63.5,49.53 | v63.5,59.69 60.96,62.23 50.8,62.23 PS12B.1
N$23
  Top 0.457: LED11.A RL11.1
N$24
  Bottom 0.457: LED7.A 66.04,73.66 RL7.1
N$25
  Bottom 0.914: PS7.2 76.2,76.2 72.39,80.01 D7.2
N$26
  Bottom 0.457: LED13.A 20.32,73.66 RL13.1
N$27
  Top 0.914: PS13.2 27.94,74.93 27.94,80.01 D13.2
N$28
  Bottom 0.457: LED8.A 50.8,73.66 RL8.1
N$29
  Bottom 0.914: PS8.2 60.96,76.2 57.15,80.01 D8.2
N$31
  Bottom 0.457: LED3.A 31.75,45.72 RL3.1
N$32
  Bottom 0.914: D3-5-6.2 PS3.2
N$34
  Top 0.914: PS8.1 58.42,64.77 IC2.11
  Bottom 0.914: IC2.12 IC2.11
N$37
  Bottom 0.914: PS5.2 29.21,63.5 16.51,63.5 16.51,57.15 19.05,54.61 19.05,53.34 17.78,52.07 16.51,52.07 D3-5-6.3
N$39  (via drill 0.61)
  Top 0.914: v29.21,43.18 29.21,52.07 26.67,54.61 PS6.2
  Bottom 0.914: v29.21,43.18 11.43,43.18 11.43,48.26 12.7,49.53 13.97,49.53 D3-5-6.4
N$40
  Top 0.914: IC2.16 IC2.15
  Bottom 0.914: PS4.1 85.09,60.96 80.01,60.96 74.93,55.88 49.53,55.88 IC2.16
N$41  (via drill 0.61)
  Top 0.914: IC2.13 v53.34,63.5
  Bottom 0.914: IC2.14 IC2.13 | PS7.1 72.39,63.5 v53.34,63.5
RX
  Bottom 0.457: ARDUINO1.2 104.14,55.88 107.95,55.88 110.49,53.34 DATA.4
TX
  Bottom 0.457: ARDUINO1.1 93.98,44.45 95.25,45.72 100.33,45.72 107.95,53.34 DATA.5

### Text on the board
tPlace: 5V | 12V | Nano board V1